# Altium schematic sheet Conn.SchDoc: Модуль измерительный
size 420 x 297 mm; CheckedBy: Беляев; Author: Петрова; CompanyName: Университет ИТМО; SheetNumber: 1; SheetTotal: 13; PageSetup: Record=PageOptions|CenterHorizontal=True|CenterVertical=True|PrintScale=0.94|XCorrection=1.00|YCorrection=1.00|PrintKind=1|BorderSize=5000000|LeftOffset=0|BottomOffset=0|Orientation=1|PaperLength=1000|PaperWidth=1000|Scale=100|PaperSource=7|PrintQuality=-4|MediaType=1|DitherType=10|PaperKind=A4|PrintScaleMode=1; DecimalNumber: СНАБ.468222.001 ЭЗ; Name: Модуль измерительный; DocumentName: Sheet1.SCHDOC
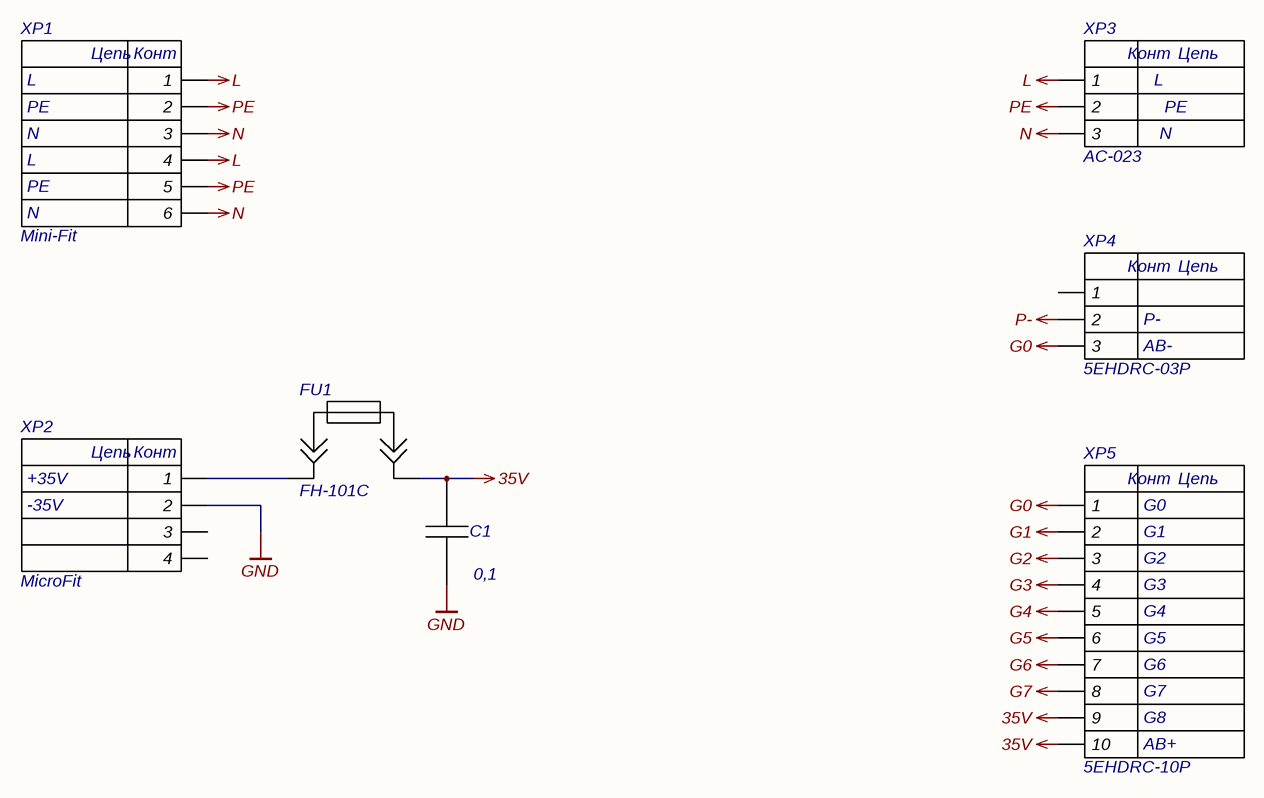
[diagram p0: Conn.SchDoc]

## Parts
C1  0,1  [С0805]
FU1  FH-101C  [FH-101C]
XP1  Mini-Fit  P6: N  P5: PE  P4: L  [MF2x3MA]
XP2  MicroFit  P2: -35V  P1: +35V  [MF3-04MA]
XP3  AC-023  [IEC-C14]
XP4  5EHDRC-03P  P2: P-  P3: AB-  [5EHDRC-03P]
XP5  5EHDRC-10P  P6: G5  P1: G0  P2: G1  P3: G2  P4: G3  P5: G4  P7: G6  P8: G7  P9: G8  P10: AB+  [5EHDRC-10P]

## Nets
35V: C1.2 FU1.2 XP5.9 XP5.10
G0: XP4.3 XP5.1
G1: XP5.2
G2: XP5.3
G3: XP5.4
G4: XP5.5
G5: XP5.6
G6: XP5.7
G7: XP5.8
GND: C1.1 XP2.2
L: XP1.1 XP1.4 XP3.1
N: XP1.3 XP1.6 XP3.3
P-: XP4.2
PE: XP1.2 XP1.5 XP3.2
NetFU1_1: FU1.1 XP2.1

Not connected (* = marked no-connect by the designer): XP2 3 4; XP4 1

## Notes on the sheet
- Перв.примен.
- Справ.№
- Подп. и дата
- Инв.№ дубл.
- Взам.инв.№
- Подп.и дата
- Разраб.
- Изм.
- Лист
- № докум.
- Подп.
- Дата
- Лит.
- Масса
- Масштаб
- Т.контр.
- Пров.
- Схема электрическая
- принципиальная
- Листов
- Инв.№ подл.
- Утв.
- Н.контр.
- Копировал
- Формат  A3
- (in symbol 5EHDRC-03P) Конт; Цепь
- (in symbol 5EHDRC-10P) Конт; Цепь
- (in symbol 43045-0412) Цепь; Конт
- (in symbol AC-023) Конт; Цепь; L; PE; N
- (in symbol MF2x3MA) Цепь; Конт

## Library data of the parts
C1 = Chip Capasitor: Чип-конденсатор; Value: 0,1
FU1 = FH-101C: Fuse holder 5x20mm; Manufacturer: Dragon City Industries; Case: FH-101C; Name: FH-101C; Datasheet: https://static.chipdip.ru/lib/550/DOC014550336.pdf
XP1 = MF2x3MA: Mini-Fit 4,2mm A Male 6 pin; Manufacturer: Connfly Electronic Co.; Name: DS1073-01-2x3-MVT6; Case: MF2x3MA; P3: N; P2: PE; P1: L
XP2 = 43045-0412: MicroFit 3mm RA Male 4 pin; Manufacturer: Molex Incorporated; Case: MF3-04MA; Name: 43045-0412; TU: *
XP3 = AC-023: Разъём питания AC, одинарный; Manufacturer: RUICHI; Name: AC-023
XP4 = 5EHDRC-03P: Клеммник 3 конт. "вилка" шаг 5.00 мм; Manufacturer: Dinkle Enterprise; Name: 5EHDRC-03P; Datasheet: https://static.chipdip.ru/lib/008/DOC004008828.pdf
XP5 = 5EHDRC-10P: Клеммник 10 конт. "вилка" шаг 5.00 мм; Manufacturer: Dinkle Enterprise; Name: 5EHDRC-10P; Datasheet: https://www.lcsc.com/datasheet/lcsc_datasheet_2311281934_Dinkle-5EHDR-10P_C5515183.pdf